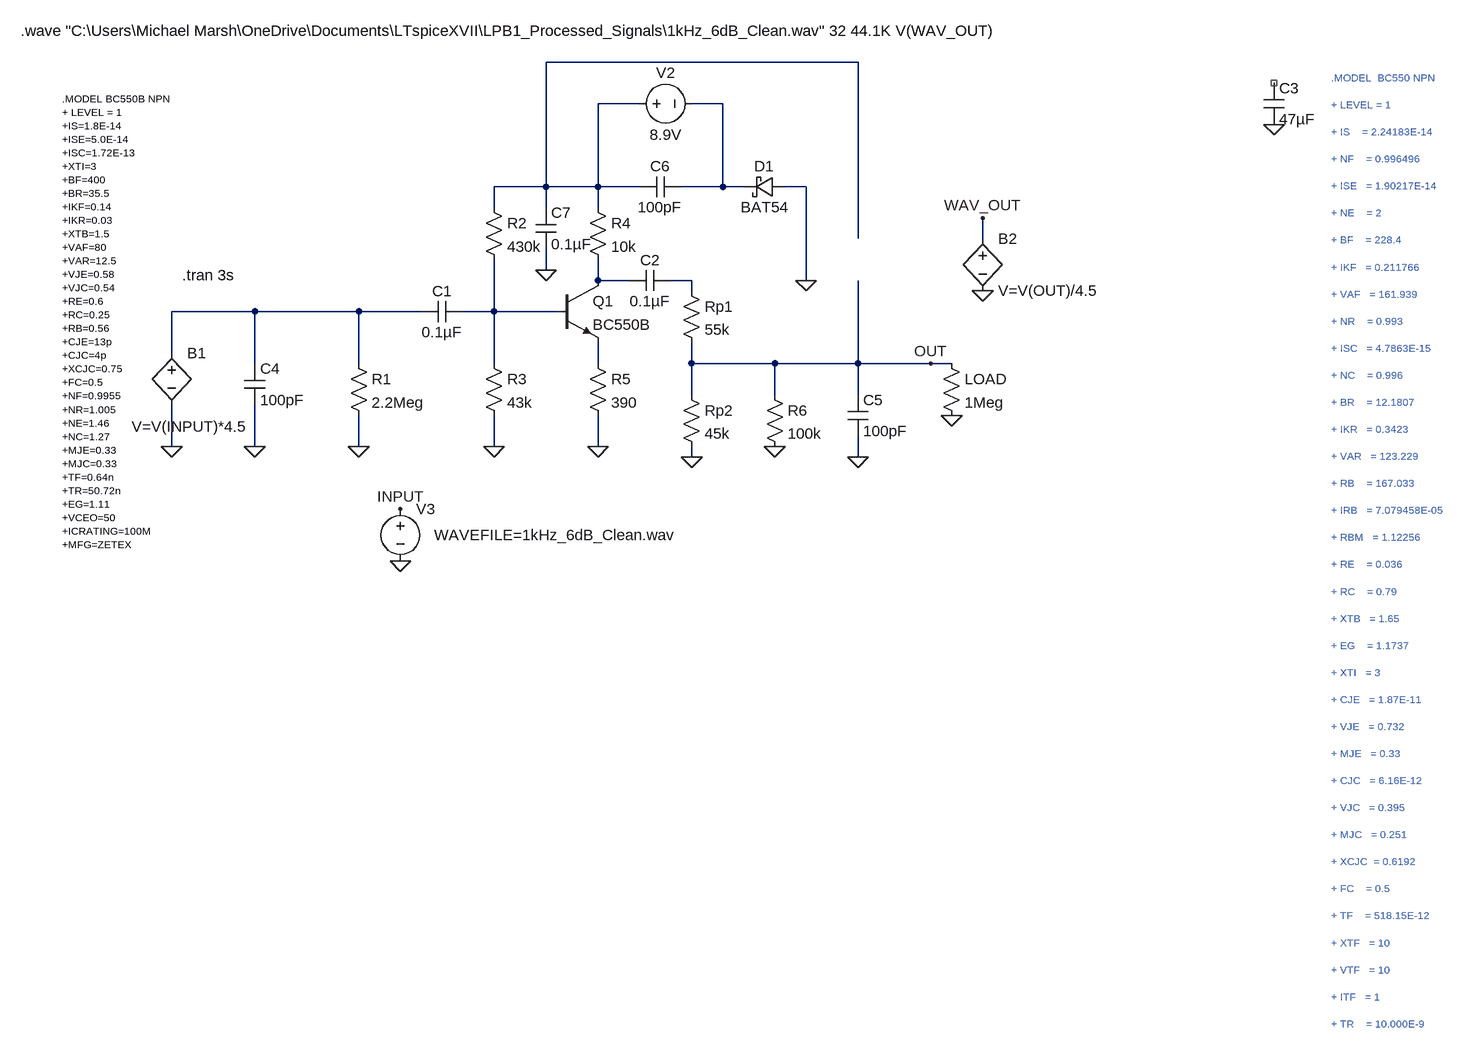
[diagram p0: schematic Reverse_Engineered_LPB1.asc]
Reverse_Engineered_LPB1.asc, the LTspice schematic file:
Version 4
SHEET 1 3360 680
WIRE 832 -256 352 -256
WIRE 496 -192 432 -192
WIRE 624 -192 576 -192
WIRE 352 -64 352 -256
WIRE 352 -64 272 -64
WIRE 432 -64 432 -192
WIRE 432 -64 352 -64
WIRE 496 -64 432 -64
WIRE 624 -64 624 -192
WIRE 624 -64 560 -64
WIRE 656 -64 624 -64
WIRE 752 -64 720 -64
WIRE 272 -32 272 -64
WIRE 352 -32 352 -64
WIRE 432 -32 432 -64
WIRE 832 16 832 -256
WIRE 1024 16 1024 -16
WIRE 352 64 352 32
WIRE 432 80 432 48
WIRE 480 80 432 80
WIRE 576 80 544 80
WIRE 752 80 752 -64
WIRE 576 96 576 80
WIRE -96 128 -224 128
WIRE 64 128 -96 128
WIRE 160 128 64 128
WIRE 272 128 272 48
WIRE 272 128 224 128
WIRE 368 128 272 128
WIRE -224 192 -224 128
WIRE -96 208 -96 128
WIRE 64 208 64 128
WIRE 272 208 272 128
WIRE 432 208 432 176
WIRE 576 208 576 176
WIRE 704 208 576 208
WIRE 832 208 832 80
WIRE 832 208 704 208
WIRE 944 208 832 208
WIRE 976 208 944 208
WIRE 576 256 576 208
WIRE 704 256 704 208
WIRE 832 256 832 208
WIRE -224 336 -224 272
WIRE -96 336 -96 272
WIRE 64 336 64 288
WIRE 272 336 272 288
WIRE 432 336 432 288
WIRE 576 352 576 336
WIRE 832 352 832 320
FLAG 432 336 0
FLAG 352 64 0
FLAG 752 80 0
FLAG 944 208 OUT
FLAG -224 336 0
FLAG -96 336 0
FLAG 64 336 0
FLAG 272 336 0
FLAG 576 352 0
FLAG 704 336 0
FLAG 832 352 0
FLAG 976 288 0
FLAG 1472 -160 0
FLAG 128 512 0
FLAG 128 432 INPUT
FLAG 1024 -16 WAV_OUT
FLAG 1024 96 0
SYMBOL res 48 192 R0
SYMATTR InstName R1
SYMATTR Value 2.2Meg
SYMBOL res 256 -48 R0
SYMATTR InstName R2
SYMATTR Value 430k
SYMBOL res 256 192 R0
SYMATTR InstName R3
SYMATTR Value 43k
SYMBOL res 416 -48 R0
SYMATTR InstName R4
SYMATTR Value 10k
SYMBOL res 416 192 R0
SYMATTR InstName R5
SYMATTR Value 390
SYMBOL res 688 240 R0
SYMATTR InstName R6
SYMATTR Value 100k
SYMBOL cap 224 112 R90
WINDOW 0 0 32 VBottom 2
WINDOW 3 32 32 VTop 2
SYMATTR InstName C1
SYMATTR Value 0.1µF
SYMBOL cap 544 64 R90
WINDOW 0 0 32 VBottom 2
WINDOW 3 32 32 VTop 2
SYMATTR InstName C2
SYMATTR Value 0.1µF
SYMBOL cap 1456 -224 R0
SYMATTR InstName C3
SYMATTR Value 47µF
SYMBOL cap -112 208 R0
SYMATTR InstName C4
SYMATTR Value 100pF
SYMBOL cap 816 256 R0
SYMATTR InstName C5
SYMATTR Value 100pF
SYMBOL cap 336 -32 R0
SYMATTR InstName C7
SYMATTR Value 0.1µF
SYMBOL npn 368 80 R0
SYMATTR InstName Q1
SYMATTR Value BC550B
SYMBOL schottky 720 -80 R90
WINDOW 0 0 32 VBottom 2
WINDOW 3 32 32 VTop 2
SYMATTR InstName D1
SYMATTR Value BAT54
SYMATTR Description Diode
SYMATTR Type diode
SYMBOL voltage 128 416 R0
WINDOW 3 52 56 Left 2
WINDOW 123 0 0 Left 0
WINDOW 39 0 0 Left 0
SYMATTR Value WAVEFILE=1kHz_6dB_Clean.wav
SYMATTR InstName V3
SYMBOL voltage 480 -192 R270
WINDOW 0 32 56 VTop 2
WINDOW 3 -32 56 VBottom 2
SYMATTR InstName V2
SYMATTR Value 8.9V
SYMBOL res 560 240 R0
SYMATTR InstName Rp2
SYMATTR Value 45k
SYMBOL cap 560 -80 R90
WINDOW 0 0 32 VBottom 2
WINDOW 3 32 32 VTop 2
SYMATTR InstName C6
SYMATTR Value 100pF
SYMBOL res 560 80 R0
SYMATTR InstName Rp1
SYMATTR Value 55k
SYMBOL res 960 192 R0
SYMATTR InstName LOAD
SYMATTR Value 1Meg
SYMBOL bv -224 176 R0
WINDOW 3 -61 129 Left 2
SYMATTR Value V=V(INPUT)*4.5
SYMATTR InstName B1
SYMBOL bv 1024 0 R0
SYMATTR InstName B2
SYMATTR Value V=V(OUT)/4.5
TEXT -208 72 Left 2 !.tran 3s
TEXT 1560 -232 Left 1 ;.MODEL  BC550 NPN\n\n+ LEVEL = 1\n\n+ IS    = 2.24183E-14\n\n+ NF    = 0.996496\n\n+ ISE   = 1.90217E-14\n\n+ NE    = 2\n\n+ BF    = 228.4\n\n+ IKF   = 0.211766\n\n+ VAF   = 161.939\n\n+ NR    = 0.993\n\n+ ISC   = 4.7863E-15\n\n+ NC    = 0.996 \n\n+ BR    = 12.1807\n\n+ IKR   = 0.3423\n\n+ VAR   = 123.229\n\n+ RB    = 167.033\n\n+ IRB   = 7.079458E-05\n\n+ RBM   = 1.12256\n\n+ RE    = 0.036\n\n+ RC    = 0.79\n\n+ XTB   = 1.65\n\n+ EG    = 1.1737\n\n+ XTI   = 3\n\n+ CJE   = 1.87E-11\n\n+ VJE   = 0.732\n\n+ MJE   = 0.33\n\n+ CJC   = 6.16E-12\n\n+ VJC   = 0.395\n\n+ MJC   = 0.251\n\n+ XCJC  = 0.6192\n\n+ FC    = 0.5 \n\n+ TF    = 518.15E-12\n\n+ XTF   = 10\n\n+ VTF   = 10\n\n+ ITF   = 1\n\n+ TR    = 10.000E-9
TEXT -392 -200 Left 1 !.MODEL BC550B NPN\n+ LEVEL = 1\n+IS=1.8E-14 \n+ISE=5.0E-14 \n+ISC=1.72E-13 \n+XTI=3 \n+BF=400 \n+BR=35.5 \n+IKF=0.14 \n+IKR=0.03 \n+XTB=1.5 \n+VAF=80 \n+VAR=12.5 \n+VJE=0.58 \n+VJC=0.54 \n+RE=0.6 \n+RC=0.25 \n+RB=0.56 \n+CJE=13p \n+CJC=4p \n+XCJC=0.75 \n+FC=0.5 \n+NF=0.9955 \n+NR=1.005 \n+NE=1.46 \n+NC=1.27 \n+MJE=0.33 \n+MJC=0.33 \n+TF=0.64n \n+TR=50.72n \n+EG=1.11 \n+VCEO=50 \n+ICRATING=100M \n+MFG=ZETEX
TEXT -456 -304 Left 2 !.wave "C:\\Users\\Michael Marsh\\OneDrive\\Documents\\LTspiceXVII\\LPB1_Processed_Signals\\1kHz_6dB_Clean.wav" 32 44.1K V(WAV_OUT)

The netlist it stands for:
* Reverse_Engineered_LPB1.asc
R1 N005 0 2.2Meg
R2 N001 N006 430k
R3 N006 0 43k
R4 N001 N003 10k
R5 N007 0 390
R6 OUT 0 100k
C1 N006 N005 0.1µF
C2 N004 N003 0.1µF
C3 NC_01 0 47µF
C4 N005 0 100pF
C5 OUT 0 100pF
C7 N001 0 0.1µF
Q1 N003 N006 N007 0 BC550B
D1 0 N002 BAT54
V3 INPUT 0 WAVEFILE=1kHz_6dB_Clean.wav
V2 N001 N002 8.9V
Rp2 OUT 0 45k
C6 N002 N001 100pF
Rp1 N004 OUT 55k
R§LOAD OUT 0 1Meg
B1 N005 0 V=V(INPUT)*4.5
B2 WAV_OUT 0 V=V(OUT)/4.5
.model D D
.lib standard.dio
.model NPN NPN
.model PNP PNP
.lib standard.bjt
.tran 3s
* .MODEL  BC550 NPN
* + LEVEL = 1
* + IS    = 2.24183E-14
* + NF    = 0.996496
* + ISE   = 1.90217E-14
* + NE    = 2
* + BF    = 228.4
* + IKF   = 0.211766
* + VAF   = 161.939
* + NR    = 0.993
* + ISC   = 4.7863E-15
* + NC    = 0.996
* + BR    = 12.1807
* + IKR   = 0.3423
* + VAR   = 123.229
* + RB    = 167.033
* + IRB   = 7.079458E-05
* + RBM   = 1.12256
* + RE    = 0.036
* + RC    = 0.79
* + XTB   = 1.65
* + EG    = 1.1737
* + XTI   = 3
* + CJE   = 1.87E-11
* + VJE   = 0.732
* + MJE   = 0.33
* + CJC   = 6.16E-12
* + VJC   = 0.395
* + MJC   = 0.251
* + XCJC  = 0.6192
* + FC    = 0.5
* + TF    = 518.15E-12
* + XTF   = 10
* + VTF   = 10
* + ITF   = 1
* + TR    = 10.000E-9
.MODEL BC550B NPN
+ LEVEL = 1
+IS=1.8E-14
+ISE=5.0E-14
+ISC=1.72E-13
+XTI=3
+BF=400
+BR=35.5
+IKF=0.14
+IKR=0.03
+XTB=1.5
+VAF=80
+VAR=12.5
+VJE=0.58
+VJC=0.54
+RE=0.6
+RC=0.25
+RB=0.56
+CJE=13p
+CJC=4p
+XCJC=0.75
+FC=0.5
+NF=0.9955
+NR=1.005
+NE=1.46
+NC=1.27
+MJE=0.33
+MJC=0.33
+TF=0.64n
+TR=50.72n
+EG=1.11
+VCEO=50
+ICRATING=100M
+MFG=ZETEX
.wave "C:\Users\Michael Marsh\OneDrive\Documents\LTspiceXVII\LPB1_Processed_Signals\1kHz_6dB_Clean.wav" 32 44.1K V(WAV_OUT)
.backanno
.end